# Altium schematic sheet CPU.SchDoc
size A3
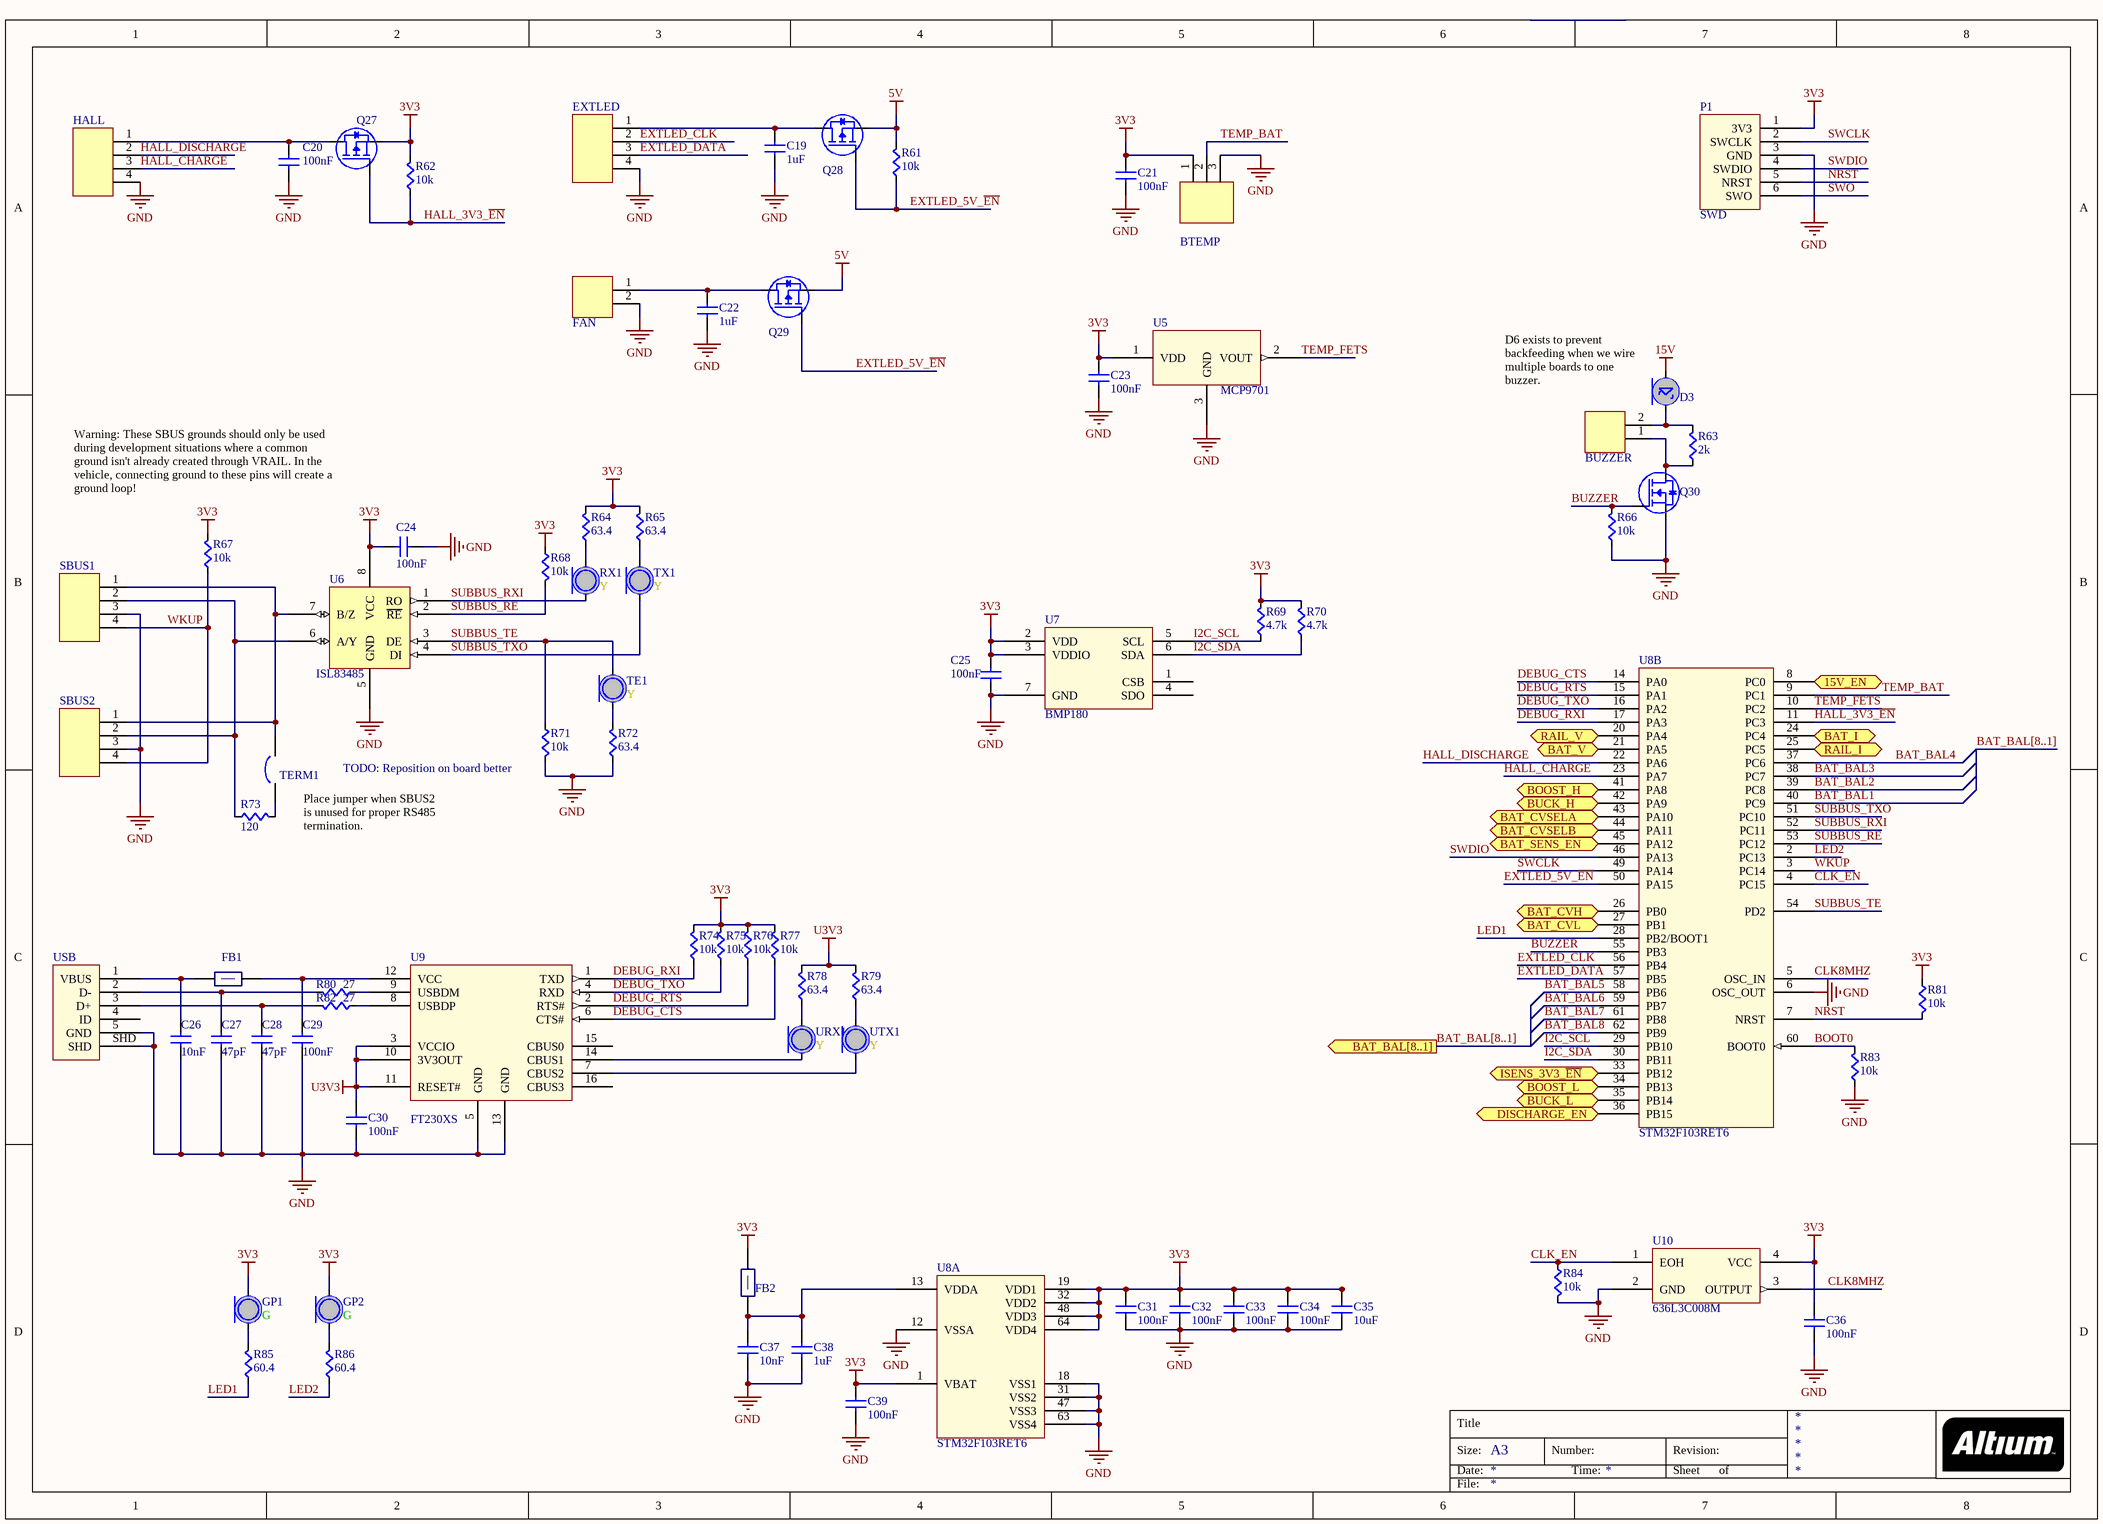
[diagram p0: CPU.SchDoc]

## Parts
BTEMP  3pos RA sherlock connector  [MOLEX-HDR-1X3-SHERLOCK-RA]  (value not drawn)
BUZZER  2-pin Horz Sherlock  [MOLEX-HDR-1X2-SHERLOCK-HORZ]  (value not drawn)
C19  value 1uF  [CAPC0805]  (hidden comment: Cap)
C20  value 100nF  [CAPC0603]  (hidden comment: Cap)
C21  value 100nF  [CAPC0603]  (hidden comment: Cap)
C22  value 1uF  [CAPC0805]  (hidden comment: Cap)
C23  value 100nF  [CAPC0603]  (hidden comment: Cap)
C24  value 100nF  [CAPC0603]  (hidden comment: Cap)
C25  value 100nF  [CAPC0603]  (hidden comment: Cap)
C26  value 10nF  [CAPC0603]  (hidden comment: Cap)
C27  value 47pF  [CAPC0603]  (hidden comment: Cap)
C28  value 47pF  [CAPC0603]  (hidden comment: Cap)
C29  value 100nF  [CAPC0603]  (hidden comment: Cap)
C30  value 100nF  [CAPC0603]  (hidden comment: Cap)
C31  value 100nF  [CAPC0603]  (hidden comment: Cap)
C32  value 100nF  [CAPC0603]  (hidden comment: Cap)
C33  value 100nF  [CAPC0603]  (hidden comment: Cap)
C34  value 100nF  [CAPC0603]  (hidden comment: Cap)
C35  value 10uF  [CAPC0603]  (hidden comment: Cap)
C36  value 100nF  [CAPC0603]  (hidden comment: Cap)
C37  value 10nF  [CAPC0603]  (hidden comment: Cap)
C38  value 1uF  [CAPC0805]  (hidden comment: Cap)
C39  value 100nF  [CAPC0603]  (hidden comment: Cap)
D3  DFLS160  [POWERDI123]  (value not drawn)
EXTLED  MOLEX-HDR-1x4-SHERLOCK_RA  [MOLEX-HDR-1X4-SHERLOCK-RA]  (value not drawn)
FAN  2-pin Vert Sherlock  [MOLEX-HDR-1X2-SHERLOCK-VERT]  (value not drawn)
FB1  FBead  [RES0603]  (value not drawn)
FB2  FBead  [RES0603]  (value not drawn)
GP1  Color: G  [LED0805]  (hidden comment: LED)
GP2  Color: G  [LED0805]  (hidden comment: LED)
HALL  MOLEX-HDR-1x4-SHERLOCK_VERT  [MOLEX-HDR-1X4-SHERLOCK-VERT]  (value not drawn)
P1  SWD  [SWD_STM32]
Q27  FDN5618P  [PowerSOT-3]  (value not drawn)
Q28  FDN5618P  [PowerSOT-3]  (value not drawn)
Q29  FDN5618P  [PowerSOT-3]  (value not drawn)
Q30  FDN5630  [PowerSOT-3]  (value not drawn)
R61  value 10k  [RES0603]  (hidden comment: Res)
R62  value 10k  [RES0603]  (hidden comment: Res)
R63  value 2k  [RES0603]  (hidden comment: Res)
R64  value 63.4  [RES0603]  (hidden comment: Res)
R65  value 63.4  [RES0603]  (hidden comment: Res)
R66  value 10k  [RES0603]  (hidden comment: Res)
R67  value 10k  [RES0603]  (hidden comment: Res)
R68  value 10k  [RES0603]  (hidden comment: Res)
R69  value 4.7k  [RES0603]  (hidden comment: Res)
R70  value 4.7k  [RES0603]  (hidden comment: Res)
R71  value 10k  [RES0603]  (hidden comment: Res)
R72  value 63.4  [RES0603]  (hidden comment: Res)
R73  value 120  [RES0603]  (hidden comment: Res)
R74  value 10k  [RES0603]  (hidden comment: Res)
R75  value 10k  [RES0603]  (hidden comment: Res)
R76  value 10k  [RES0603]  (hidden comment: Res)
R77  value 10k  [RES0603]  (hidden comment: Res)
R78  value 63.4  [RES0603]  (hidden comment: Res)
R79  value 63.4  [RES0603]  (hidden comment: Res)
R80  value 27  [RES0603]  (hidden comment: Res)
R81  value 10k  [RES0603]  (hidden comment: Res)
R82  value 27  [RES0603]  (hidden comment: Res)
R83  value 10k  [RES0603]  (hidden comment: Res)
R84  value 10k  [RES0603]  (hidden comment: Res)
R85  value 60.4  [RES0603]  (hidden comment: Res)
R86  value 60.4  [RES0603]  (hidden comment: Res)
RX1  Color: Y  [LED0805]  (hidden comment: LED)
SBUS1  MOLEX-HDR-1x4-SHERLOCK_RA  [MOLEX-HDR-1X4-SHERLOCK-RA]  (value not drawn)
SBUS2  MOLEX-HDR-1x4-SHERLOCK_RA  [MOLEX-HDR-1X4-SHERLOCK-RA]  (value not drawn)
TE1  Color: Y  [LED0805]  (hidden comment: LED)
TERM1  Jumper  [HEADER_MALE_1X2]  (value not drawn)
TX1  Color: Y  [LED0805]  (hidden comment: LED)
U5  MCP9701  [MCP970X-E/TT]
U6  ISL83485  [ISL8348xIBZ]
U7  BMP180  [BMP180]
U8  STM32F103RET6  [STM32F103RxTx]  (parts A,B of 2)
U9  FT230XS  [FT230XS]
U10  636L3C008M  [636L3C]
URX1  Color: Y  [LED0805]  (hidden comment: LED)
USB  UX60SC-MB-5ST  [UX60SC-MB-5ST]  (value not drawn)
UTX1  Color: Y  [LED0805]  (hidden comment: LED)

## Ports
15V_EN (out), BAT_BAL[8..1] (out), BAT_CVH (in), BAT_CVL (in), BAT_CVSELA (out), BAT_CVSELB (out), BAT_I (in), BAT_SENS_EN (out), BAT_V (in), BOOST_H (out), BOOST_L (out), BUCK_H (out), BUCK_L (out), DISCHARGE_EN (out), ISENS_3V3_~{EN} (out), RAIL_I (in), RAIL_V (in)

## Nets
3V3: BTEMP.1 C21.2(B) C23.2(B) C24.2(B) C25.1(A) C31.1(A) C32.1(A) C33.1(A) C34.1(A) C35.1(A) C36.1(A) C39.1(A) FB2.2(B) GP1.A GP2.A P1.1(3V3) Q27.S R62.1(A) R64.1(A) R65.1(A) R67.1(A) R68.1(A) R69.1(A) R70.1(A) R74.1(A) R75.1(A) R76.1(A) R77.1(A) R81.1(A) U5.1(VDD) U6.8(VCC) U7.2(VDD) U7.3(VDDIO) U8.1(VBAT) U8.19(VDD1) U8.32(VDD2) U8.48(VDD3) U8.64(VDD4) U10.4(VCC)
5V: Q28.S Q29.S R61.1(A)
15V: D3.A
GND: BTEMP.3 C19.2(B) C20.2(B) C21.1(A) C22.2(B) C23.1(A) C24.1(A) C25.2(B) C26.2(B) C27.2(B) C28.2(B) C29.2(B) C30.2(B) C31.2(B) C32.2(B) C33.2(B) C34.2(B) C35.2(B) C36.2(B) C37.2(B) C38.2(B) C39.2(B) EXTLED.4 FAN.2 HALL.4 P1.3(GND) Q30.S R66.2(B) R71.2(B) R72.2(B) R83.2(B) R84.1(A) SBUS1.3 SBUS2.3 U5.3(GND) U6.5(GND) U7.7(GND) U8.6(OSC_OUT) U8.12(VSSA) U8.18(VSS1) U8.31(VSS2) U8.47(VSS3) U8.63(VSS4) U9.5(GND) U9.13(GND) U10.2(GND) USB.5(GND) USB.SHD
U3V3: C30.1(A) R78.1(A) R79.1(A) U9.3(VCCIO) U9.10(3V3OUT) U9.11(RESET#)
15V_EN: U8.8(PC0) ; port 15V_EN
BAT_BAL1: U8.40(PC9)
BAT_BAL2: U8.39(PC8)
BAT_BAL3: U8.38(PC7)
BAT_BAL4: U8.37(PC6)
BAT_BAL5: U8.58(PB6)
BAT_BAL6: U8.59(PB7)
BAT_BAL7: U8.61(PB8)
BAT_BAL8: U8.62(PB9)
BAT_CVH: U8.26(PB0) ; port BAT_CVH
BAT_CVL: U8.27(PB1) ; port BAT_CVL
BAT_CVSELA: U8.43(PA10) ; port BAT_CVSELA
BAT_CVSELB: U8.44(PA11) ; port BAT_CVSELB
BAT_I: U8.24(PC4) ; port BAT_I
BAT_SENS_EN: U8.45(PA12) ; port BAT_SENS_EN
BAT_V: U8.21(PA5) ; port BAT_V
BOOST_H: U8.41(PA8) ; port BOOST_H
BOOST_L: U8.34(PB13) ; port BOOST_L
BOOT0: R83.1(A) U8.60(BOOT0)
BUCK_H: U8.42(PA9) ; port BUCK_H
BUCK_L: U8.35(PB14) ; port BUCK_L
BUZZER: Q30.G R66.1(A) U8.55(PB3)
CLK8MHZ: U8.5(OSC_IN) U10.3(OUTPUT)
CLK_EN: R84.2(B) U8.4(PC15) U10.1(EOH)
DEBUG_CTS: R77.2(B) U8.14(PA0) U9.6(CTS#)
DEBUG_RTS: R76.2(B) U8.15(PA1) U9.2(RTS#)
DEBUG_RXI: R74.2(B) U8.17(PA3) U9.1(TXD)
DEBUG_TXO: R75.2(B) U8.16(PA2) U9.4(RXD)
DISCHARGE_EN: U8.36(PB15) ; port DISCHARGE_EN
EXTLED_5V_~{EN}: Q28.G Q29.G R61.2(B) U8.50(PA15)
EXTLED_CLK: EXTLED.2 U8.56(PB4)
EXTLED_DATA: EXTLED.3 U8.57(PB5)
HALL_3V3_~{EN}: Q27.G R62.2(B) U8.11(PC3)
HALL_CHARGE: HALL.3 U8.23(PA7)
HALL_DISCHARGE: HALL.2 U8.22(PA6)
I2C_SCL: R69.2(B) U7.5(SCL) U8.29(PB10)
I2C_SDA: R70.2(B) U7.6(SDA) U8.30(PB11)
ISENS_3V3_~{EN}: U8.33(PB12) ; port ISENS_3V3_~{EN}
LED1: R85.2(B) U8.28(PB2/BOOT1)
LED2: R86.2(B) U8.2(PC13)
NRST: P1.5(NRST) R81.2(B) U8.7(NRST)
RAIL_I: U8.25(PC5) ; port RAIL_I
RAIL_V: U8.20(PA4) ; port RAIL_V
SUBBUS_RE: R68.2(B) U6.2(~{RE}) U8.53(PC12)
SUBBUS_RXI: RX1.C U6.1(RO) U8.52(PC11)
SUBBUS_TE: R71.1(A) TE1.A U6.3(DE) U8.54(PD2)
SUBBUS_TXO: TX1.C U6.4(DI) U8.51(PC10)
SWCLK: P1.2(SWCLK) U8.49(PA14)
SWDIO: P1.4(SWDIO) U8.46(PA13)
SWO: P1.6(SWO)
TEMP_BAT: BTEMP.2 U8.9(PC1)
TEMP_FETS: U5.2(VOUT) U8.10(PC2)
WKUP: R67.2(B) SBUS1.4 SBUS2.4 U8.3(PC14)
NetBUZZER_1: BUZZER.1 Q30.D R63.2(B)
NetBUZZER_2: BUZZER.2 D3.C R63.1(A)
NetC19_1: C19.1(A) EXTLED.1 Q28.D
NetC20_1: C20.1(A) HALL.1 Q27.D
NetC22_1: C22.1(A) FAN.1 Q29.D
NetC26_1: C26.1(A) FB1.2(B) USB.1(VBUS)
NetC27_1: C27.1(A) R80.1(A) USB.2(D-)
NetC28_1: C28.1(A) R82.1(A) USB.3(D+)
NetC29_1: C29.1(A) FB1.1(A) U9.12(VCC)
NetC37_1: C37.1(A) C38.1(A) FB2.1(A) U8.13(VDDA)
NetGP1_C: GP1.C R85.1(A)
NetGP2_C: GP2.C R86.1(A)
NetR64_2: R64.2(B) RX1.A
NetR65_2: R65.2(B) TX1.A
NetR72_1: R72.1(A) TE1.C
NetR73_1: R73.1(A) TERM1.1
NetR73_2: R73.2(B) SBUS1.2 SBUS2.2 U6.6(A/Y)
NetR78_2: R78.2(B) URX1.A
NetR79_2: R79.2(B) UTX1.A
NetR80_2: R80.2(B) U9.9(USBDM)
NetR82_2: R82.2(B) U9.8(USBDP)
NetSBUS1_1: SBUS1.1 SBUS2.1 TERM1.2 U6.7(B/Z)
NetU9_7: U9.7(CBUS2) UTX1.C
NetU9_14: U9.14(CBUS1) URX1.C

Not connected (* = marked no-connect by the designer): U7 1(CSB) 4(SDO); U9 15(CBUS0) 16(CBUS3); USB 4(ID)

## Buses and harness runs
bus BAT_BAL[8..1]
bus BAT_BAL[8..1] = port BAT_BAL[8..1]

## Notes on the sheet
- D6 exists to prevent backfeeding when we wire multiple boards to one buzzer.
- (near R67) Warning: These SBUS grounds should only be used during development situations where a common ground isn't already created through VRAIL. In the vehicle, connecting ground to these pins will create a ground loop!
- (near R71) TODO: Reposition on board better
- Place jumper when SBUS2 is unused for proper RS485 termination.
- Title
- Size:
- Date:
- A3
- Number:
- Time:
- Revision:
- Sheet
- of
- File:

## Library data of the parts
BTEMP = MOLEX-HDR-1x3-SHERLOCK_RA: Header, Molex, 2mm Pitch Sherlock Header, Single Row, Right Angle 3 Circuits, Length 3.3mm; Manufacturer Part Number: 35363-0360; Manufacturer: Molex Connector Corporation; Supplier Part Number: WM18932-ND; Supplier: Digi-Key
BUZZER = MOLEX-HDR-1x2-SHERLOCK_RA: Header, Molex, 2mm Pitch Sherlock Header, Single Row, Horizontal, 2 Circuits, Length 3.3mm,  0353630260; Manufacturer: Molex Inc; Manufacturer Part Number: 0353630260; Supplier Part Number: WM18931-ND; Supplier: Digi-Key
C39 = Cap: Manufacturer: Kemet; Manufacturer PN: C0603C104K8RACTU; Distributor: Digikey; Distributor PN: 399-1095-1-ND; Supplier 1: Digi-Key; Supplier Part Number 1: 1276-1000-1-ND
D3 = DFLS160: 1.0A Surface Mount Schottky Barrier Rectifier; Supplier 1: Digi-Key; Supplier Part Number 1: DFLS160DICT-ND
EXTLED SBUS1 SBUS2 = MOLEX-HDR-1x4-SHERLOCK_RA: Header, Molex, 2mm Pitch Sherlock Header, Single Row, Horizontal, 4 Circuits, Length 3.3mm; Manufacturer Part Number: 0353630460; Supplier Part Number: WM18933-ND; Manufacturer: Molex; Supplier: Digikey
FAN = MOLEX-HDR-1x2-SHERLOCK_VERT: Header, Molex, 2mm Pitch Sherlock Header, Single Row, Vertical, 2 Circuits, Length 3.3mm, 0353620250; Manufacturer Part Number: *; Order Part Number: *
FB1 FB2 = FBead: Ferrite Bead; Supplier 1: Digi-Key; Supplier Part Number 1: 445-2988-1-ND
HALL = MOLEX-HDR-1x4-SHERLOCK_VERT: Header, Molex, 2mm Pitch Sherlock Header, Single Row, Vertical, 4 Circuits, Length 3.3mm, 0353620450; Manufacturer Part Number: *; Order Part Number: *
P1 = SWD_STM32: SWD connector matching the pinout on STM Discovery Boards
Q27-Q29 = FDN5618P: 60V P-Channel Logic Level PowerTrench MOSFET; Supplier 1: Digi-Key; Supplier Part Number 1: FDN5618PCT-ND
Q30 = FDN5630: 60V N-Channel PowerTrench MOSFET; Supplier 1: Digi-Key; Supplier Part Number 1: FDN5630CT-ND
TERM1 = Jumper: Single Jumper on 1x2 Male Header
U5 = MCP970x: Low-Power Linear Active Thermistor ICs; Supplier 1: Digi-Key; Supplier Part Number 1: MCP9701AT-E/TTCT-ND
U6 = ISL83485: 3.3V RS485 Transceiver; Supplier 1: Digi-Key; Supplier Part Number 1: ISL83485IBZ-ND
U7 = BMP180: Digital Pressure Sensor; Supplier 1: Digi-Key; Supplier Part Number 1: 828-1027-1-ND
U8 = STM32F103RET6: Mainstream Performance line, ARM Cortex-M3 MCU
U9 = FT230XS: USB To Basic UART IC; Supplier 1: Digi-Key; Supplier Part Number 1: 768-1154-5-ND
U10 = 636L3C: HCMOS/TTL Clock Oscillator; Supplier 1: Digi-Key; Supplier Part Number 1: CTX1005CT-ND
USB = UX60SC-MB-5ST: USB Mini B Metal Shield SMT; Supplier 1: Digi-Key; Supplier Part Number 1: H11671CT-ND
C19-C38 = Cap
  C19 C22 C38: Supplier 1: Digi-Key; Supplier Part Number 1: 1276-1029-1-ND
  C20: Supplier 1: Digi-Key; Supplier Part Number 1: 399-1095-1-ND
  C21 C23-C25 C29-C34 C36: Supplier 1: Digi-Key; Supplier Part Number 1: 1276-1000-1-ND
  C26: Supplier 1: Digi-Key; Supplier Part Number 1: 445-1311-1-ND
  C27 C28: Supplier 1: Digi-Key; Supplier Part Number 1: 445-1277-1-ND
  C35: Supplier 1: Digi-Key; Supplier Part Number 1: 1276-2876-1-ND
GP1 GP2 RX1 TE1 TX1 URX1 UTX1 = LED: Supplier 1: Digi-Key
  GP1 GP2: Supplier Part Number 1: 475-1410-1-ND
  RX1 TE1 TX1 URX1 UTX1: Supplier Part Number 1: 160-1416-1-ND
R61-R86 = Res: Supplier 1: Digi-Key
  R61 R62 R66-R68 R71 R74-R77 R81 R83 R84: Supplier Part Number 1: RMCF0603JT10K0CT-ND
  R63: Supplier Part Number 1: RMCF0603JT2K00CT-ND
  R64 R65 R72 R78 R79: Supplier Part Number 1: RMCF0603FT63R4CT-ND
  R69 R70: Supplier Part Number 1: RMCF0603JT4K70CT-ND
  R73: Supplier Part Number 1: RHM120HCT-ND
  R80 R82: Supplier Part Number 1: RMCF0603JT27R0CT-ND
  R85 R86: Supplier Part Number 1: RMCF0603FT60R4CT-ND